# Altium schematic sheet hierarchy.SchDoc
size A3; SheetNumber: 1; SheetTotal: 15; SheetDescription: High Level Hierarchy
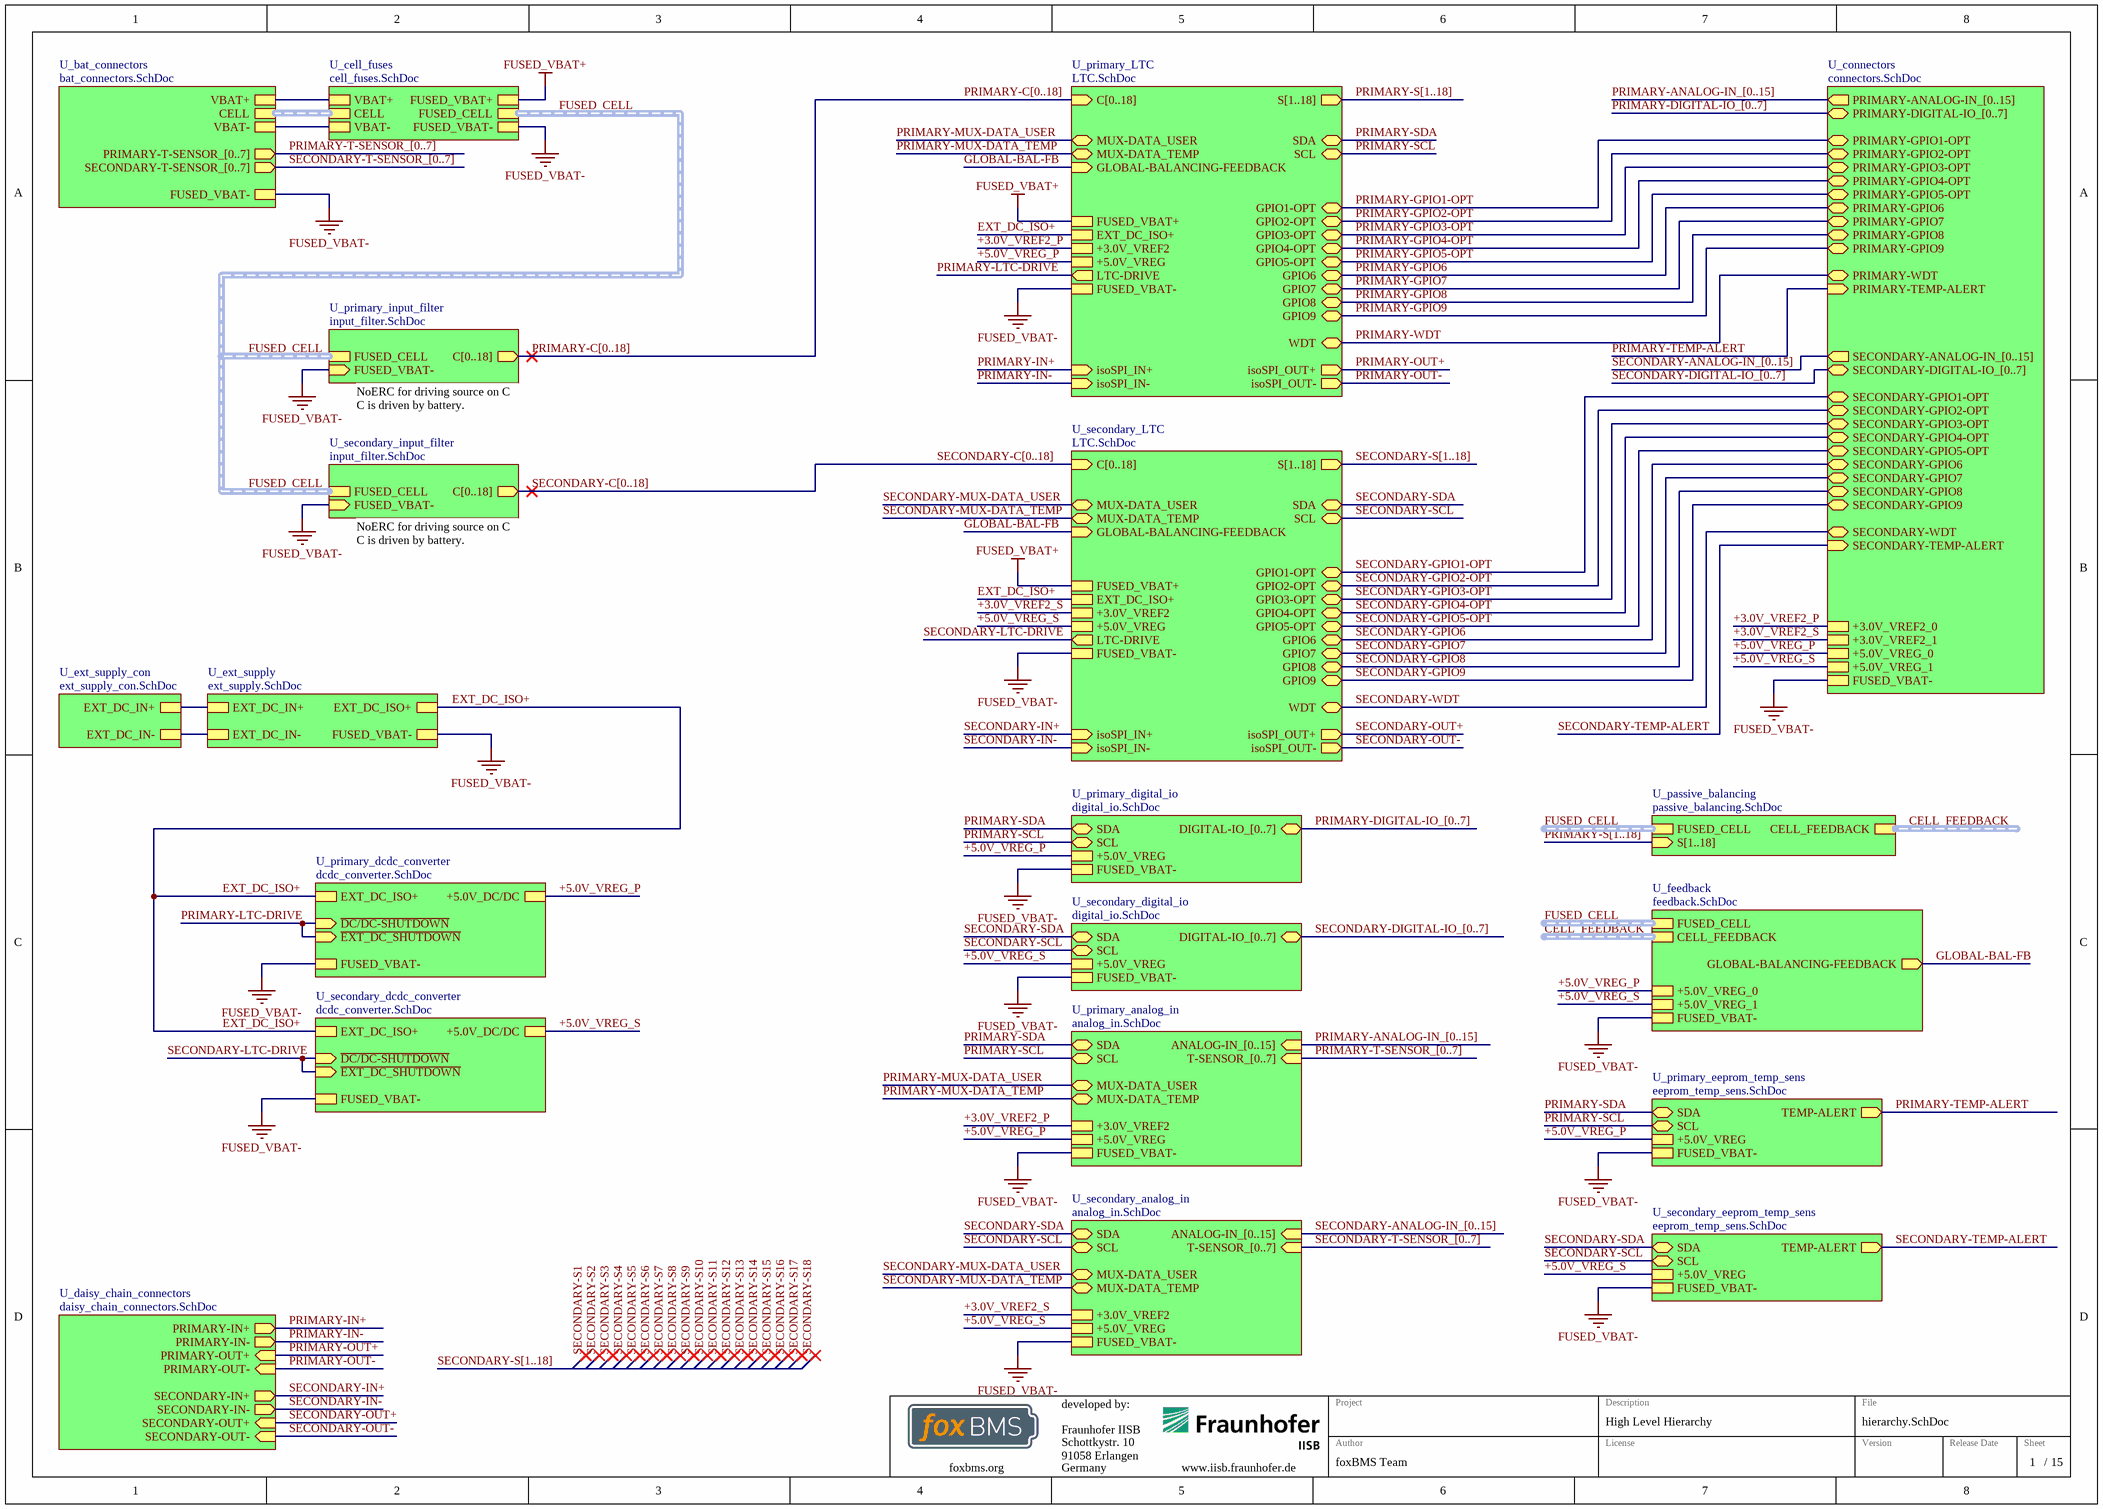
[diagram p0: hierarchy.SchDoc]

## Sub-sheets
U_bat_connectors = bat_connectors.SchDoc: CELL (harness CELL_VOLTAGES), PRIMARY-T-SENSOR_[0..7] (out), SECONDARY-T-SENSOR_[0..7] (out), VBAT+, VBAT-, FUSED_VBAT-
U_cell_fuses = cell_fuses.SchDoc: FUSED_CELL (harness CELL_VOLTAGES), CELL (harness CELL_VOLTAGES), VBAT+, VBAT-, FUSED_VBAT+, FUSED_VBAT-
U_connectors = connectors.SchDoc: PRIMARY-WDT (bidir), SECONDARY-WDT (bidir), PRIMARY-GPIO1-OPT (bidir), PRIMARY-GPIO2-OPT (bidir), PRIMARY-GPIO3-OPT (bidir), PRIMARY-GPIO4-OPT (bidir), PRIMARY-GPIO5-OPT (bidir), SECONDARY-GPIO1-OPT (bidir), SECONDARY-GPIO2-OPT (bidir), SECONDARY-GPIO3-OPT (bidir), SECONDARY-GPIO4-OPT (bidir), SECONDARY-GPIO5-OPT (bidir), PRIMARY-TEMP-ALERT (in), SECONDARY-TEMP-ALERT (in), SECONDARY-DIGITAL-IO_[0..7] (bidir), PRIMARY-DIGITAL-IO_[0..7] (bidir), PRIMARY-ANALOG-IN_[0..15] (out), SECONDARY-ANALOG-IN_[0..15] (out), PRIMARY-GPIO9 (bidir), PRIMARY-GPIO7 (bidir), PRIMARY-GPIO6 (bidir), PRIMARY-GPIO8 (bidir), SECONDARY-GPIO9 (bidir), SECONDARY-GPIO8 (bidir), SECONDARY-GPIO7 (bidir), SECONDARY-GPIO6 (bidir), +3.0V_VREF2_1, +5.0V_VREG_1, +3.0V_VREF2_0, FUSED_VBAT-, +5.0V_VREG_0
U_daisy_chain_connectors = daisy_chain_connectors.SchDoc: SECONDARY-IN+ (out), SECONDARY-IN- (out), SECONDARY-OUT+ (in), SECONDARY-OUT- (in), PRIMARY-IN+ (out), PRIMARY-IN- (out), PRIMARY-OUT- (in), PRIMARY-OUT+ (in)
U_ext_supply = ext_supply.SchDoc: EXT_DC_IN+, EXT_DC_IN-, EXT_DC_ISO+, FUSED_VBAT-
U_ext_supply_con = ext_supply_con.SchDoc: EXT_DC_IN+, EXT_DC_IN-
U_feedback = feedback.SchDoc: GLOBAL-BALANCING-FEEDBACK (out), CELL_FEEDBACK (harness CELL_FEEDBACK), FUSED_CELL (harness CELL_VOLTAGES), +5.0V_VREG_1, +5.0V_VREG_0, FUSED_VBAT-
U_passive_balancing = passive_balancing.SchDoc: FUSED_CELL (harness CELL_VOLTAGES), S[1..18] (in), CELL_FEEDBACK (harness CELL_FEEDBACK)
U_primary_analog_in = analog_in.SchDoc: MUX-DATA_TEMP (bidir), MUX-DATA_USER (bidir), ANALOG-IN_[0..15] (in), T-SENSOR_[0..7] (in), SCL (bidir), SDA (bidir), +5.0V_VREG, FUSED_VBAT-, +3.0V_VREF2
U_primary_dcdc_converter = dcdc_converter.SchDoc: +5.0V_DC/DC, FUSED_VBAT-, ~{DC/DC-SHUTDOWN} (in), EXT_DC_ISO+, ~{EXT_DC_SHUTDOWN} (in)
U_primary_digital_io = digital_io.SchDoc: SCL (bidir), SDA (bidir), DIGITAL-IO_[0..7] (bidir), +5.0V_VREG, FUSED_VBAT-
U_primary_eeprom_temp_sens = eeprom_temp_sens.SchDoc: TEMP-ALERT (out), SDA (bidir), SCL (bidir), FUSED_VBAT-, +5.0V_VREG
U_primary_input_filter = input_filter.SchDoc: FUSED_CELL (harness CELL_VOLTAGES), C[0..18] (out), FUSED_VBAT- (in)
U_primary_LTC = LTC.SchDoc: isoSPI_IN- (in), isoSPI_IN+ (in), isoSPI_OUT- (out), isoSPI_OUT+ (out), GPIO5-OPT (bidir), GPIO4-OPT (bidir), MUX-DATA_USER (bidir), GPIO1-OPT (bidir), SCL (bidir), GPIO2-OPT (bidir), MUX-DATA_TEMP (bidir), GPIO3-OPT (bidir), GLOBAL-BALANCING-FEEDBACK (in), SDA (bidir), EXT_DC_ISO+, C[0..18] (in), S[1..18] (out), WDT (bidir), GPIO8 (bidir), GPIO7 (bidir), GPIO9 (bidir), GPIO6 (bidir), FUSED_VBAT+, FUSED_VBAT-, +5.0V_VREG, +3.0V_VREF2, LTC-DRIVE (out)
U_secondary_analog_in = analog_in.SchDoc: MUX-DATA_TEMP (bidir), MUX-DATA_USER (bidir), ANALOG-IN_[0..15] (in), T-SENSOR_[0..7] (in), SCL (bidir), SDA (bidir), +5.0V_VREG, FUSED_VBAT-, +3.0V_VREF2
U_secondary_dcdc_converter = dcdc_converter.SchDoc: +5.0V_DC/DC, FUSED_VBAT-, ~{DC/DC-SHUTDOWN} (in), EXT_DC_ISO+, ~{EXT_DC_SHUTDOWN} (in)
U_secondary_digital_io = digital_io.SchDoc: SCL (bidir), SDA (bidir), DIGITAL-IO_[0..7] (bidir), +5.0V_VREG, FUSED_VBAT-
U_secondary_eeprom_temp_sens = eeprom_temp_sens.SchDoc: TEMP-ALERT (out), SDA (bidir), SCL (bidir), FUSED_VBAT-, +5.0V_VREG
U_secondary_input_filter = input_filter.SchDoc: FUSED_CELL (harness CELL_VOLTAGES), C[0..18] (out), FUSED_VBAT- (in)
U_secondary_LTC = LTC.SchDoc: isoSPI_IN- (in), isoSPI_IN+ (in), isoSPI_OUT- (out), isoSPI_OUT+ (out), GPIO5-OPT (bidir), GPIO4-OPT (bidir), MUX-DATA_USER (bidir), GPIO1-OPT (bidir), SCL (bidir), GPIO2-OPT (bidir), MUX-DATA_TEMP (bidir), GPIO3-OPT (bidir), GLOBAL-BALANCING-FEEDBACK (in), SDA (bidir), EXT_DC_ISO+, C[0..18] (in), S[1..18] (out), WDT (bidir), GPIO8 (bidir), GPIO7 (bidir), GPIO9 (bidir), GPIO6 (bidir), FUSED_VBAT+, FUSED_VBAT-, +5.0V_VREG, +3.0V_VREF2, LTC-DRIVE (out)

## Nets
FUSED_VBAT+: sheet U_cell_fuses/FUSED_VBAT+, sheet U_primary_LTC/FUSED_VBAT+, sheet U_secondary_LTC/FUSED_VBAT+
FUSED_VBAT-: sheet U_cell_fuses/FUSED_VBAT-, sheet U_primary_input_filter/FUSED_VBAT-, sheet U_secondary_input_filter/FUSED_VBAT-, sheet U_ext_supply/FUSED_VBAT-, sheet U_connectors/FUSED_VBAT-, sheet U_feedback/FUSED_VBAT-, sheet U_primary_LTC/FUSED_VBAT-, sheet U_secondary_digital_io/FUSED_VBAT-, sheet U_secondary_eeprom_temp_sens/FUSED_VBAT-, sheet U_secondary_analog_in/FUSED_VBAT-, sheet U_bat_connectors/FUSED_VBAT-, sheet U_primary_dcdc_converter/FUSED_VBAT-, sheet U_secondary_dcdc_converter/FUSED_VBAT-, sheet U_secondary_LTC/FUSED_VBAT-, sheet U_primary_digital_io/FUSED_VBAT-, sheet U_primary_eeprom_temp_sens/FUSED_VBAT-, sheet U_primary_analog_in/FUSED_VBAT-
+3.0V_VREF2_P: sheet U_connectors/+3.0V_VREF2_0, sheet U_primary_LTC/+3.0V_VREF2, sheet U_primary_analog_in/+3.0V_VREF2
+3.0V_VREF2_S: sheet U_connectors/+3.0V_VREF2_1, sheet U_secondary_analog_in/+3.0V_VREF2, sheet U_secondary_LTC/+3.0V_VREF2
+5.0V_VREG_P: sheet U_connectors/+5.0V_VREG_0, sheet U_feedback/+5.0V_VREG_0, sheet U_primary_LTC/+5.0V_VREG, sheet U_primary_dcdc_converter/+5.0V_DC/DC, sheet U_primary_digital_io/+5.0V_VREG, sheet U_primary_eeprom_temp_sens/+5.0V_VREG, sheet U_primary_analog_in/+5.0V_VREG
+5.0V_VREG_S: sheet U_connectors/+5.0V_VREG_1, sheet U_feedback/+5.0V_VREG_1, sheet U_secondary_digital_io/+5.0V_VREG, sheet U_secondary_eeprom_temp_sens/+5.0V_VREG, sheet U_secondary_analog_in/+5.0V_VREG, sheet U_secondary_dcdc_converter/+5.0V_DC/DC, sheet U_secondary_LTC/+5.0V_VREG
EXT_DC_ISO+: sheet U_ext_supply/EXT_DC_ISO+, sheet U_primary_LTC/EXT_DC_ISO+, sheet U_primary_dcdc_converter/EXT_DC_ISO+, sheet U_secondary_dcdc_converter/EXT_DC_ISO+, sheet U_secondary_LTC/EXT_DC_ISO+
GLOBAL-BAL-FB: sheet U_feedback/GLOBAL-BALANCING-FEEDBACK, sheet U_primary_LTC/GLOBAL-BALANCING-FEEDBACK, sheet U_secondary_LTC/GLOBAL-BALANCING-FEEDBACK
PRIMARY-GPIO1-OPT: sheet U_connectors/PRIMARY-GPIO1-OPT, sheet U_primary_LTC/GPIO1-OPT
PRIMARY-GPIO2-OPT: sheet U_connectors/PRIMARY-GPIO2-OPT, sheet U_primary_LTC/GPIO2-OPT
PRIMARY-GPIO3-OPT: sheet U_connectors/PRIMARY-GPIO3-OPT, sheet U_primary_LTC/GPIO3-OPT
PRIMARY-GPIO4-OPT: sheet U_connectors/PRIMARY-GPIO4-OPT, sheet U_primary_LTC/GPIO4-OPT
PRIMARY-GPIO5-OPT: sheet U_connectors/PRIMARY-GPIO5-OPT, sheet U_primary_LTC/GPIO5-OPT
PRIMARY-GPIO6: sheet U_connectors/PRIMARY-GPIO6, sheet U_primary_LTC/GPIO6
PRIMARY-GPIO7: sheet U_connectors/PRIMARY-GPIO7, sheet U_primary_LTC/GPIO7
PRIMARY-GPIO8: sheet U_connectors/PRIMARY-GPIO8, sheet U_primary_LTC/GPIO8
PRIMARY-GPIO9: sheet U_connectors/PRIMARY-GPIO9, sheet U_primary_LTC/GPIO9
PRIMARY-IN+: sheet U_primary_LTC/isoSPI_IN+, sheet U_daisy_chain_connectors/PRIMARY-IN+
PRIMARY-IN-: sheet U_primary_LTC/isoSPI_IN-, sheet U_daisy_chain_connectors/PRIMARY-IN-
PRIMARY-LTC-DRIVE: sheet U_primary_LTC/LTC-DRIVE, sheet U_primary_dcdc_converter/~{DC/DC-SHUTDOWN}, sheet U_primary_dcdc_converter/~{EXT_DC_SHUTDOWN}
PRIMARY-MUX-DATA_TEMP: sheet U_primary_LTC/MUX-DATA_TEMP, sheet U_primary_analog_in/MUX-DATA_TEMP
PRIMARY-MUX-DATA_USER: sheet U_primary_LTC/MUX-DATA_USER, sheet U_primary_analog_in/MUX-DATA_USER
PRIMARY-OUT+: sheet U_primary_LTC/isoSPI_OUT+, sheet U_daisy_chain_connectors/PRIMARY-OUT+
PRIMARY-OUT-: sheet U_primary_LTC/isoSPI_OUT-, sheet U_daisy_chain_connectors/PRIMARY-OUT-
PRIMARY-SCL: sheet U_primary_LTC/SCL, sheet U_primary_digital_io/SCL, sheet U_primary_eeprom_temp_sens/SCL, sheet U_primary_analog_in/SCL
PRIMARY-SDA: sheet U_primary_LTC/SDA, sheet U_primary_digital_io/SDA, sheet U_primary_eeprom_temp_sens/SDA, sheet U_primary_analog_in/SDA
PRIMARY-TEMP-ALERT: sheet U_connectors/PRIMARY-TEMP-ALERT, sheet U_primary_eeprom_temp_sens/TEMP-ALERT
PRIMARY-WDT: sheet U_connectors/PRIMARY-WDT, sheet U_primary_LTC/WDT
SECONDARY-GPIO1-OPT: sheet U_connectors/SECONDARY-GPIO1-OPT, sheet U_secondary_LTC/GPIO1-OPT
SECONDARY-GPIO2-OPT: sheet U_connectors/SECONDARY-GPIO2-OPT, sheet U_secondary_LTC/GPIO2-OPT
SECONDARY-GPIO3-OPT: sheet U_connectors/SECONDARY-GPIO3-OPT, sheet U_secondary_LTC/GPIO3-OPT
SECONDARY-GPIO4-OPT: sheet U_connectors/SECONDARY-GPIO4-OPT, sheet U_secondary_LTC/GPIO4-OPT
SECONDARY-GPIO5-OPT: sheet U_connectors/SECONDARY-GPIO5-OPT, sheet U_secondary_LTC/GPIO5-OPT
SECONDARY-GPIO6: sheet U_connectors/SECONDARY-GPIO6, sheet U_secondary_LTC/GPIO6
SECONDARY-GPIO7: sheet U_connectors/SECONDARY-GPIO7, sheet U_secondary_LTC/GPIO7
SECONDARY-GPIO8: sheet U_connectors/SECONDARY-GPIO8, sheet U_secondary_LTC/GPIO8
SECONDARY-GPIO9: sheet U_connectors/SECONDARY-GPIO9, sheet U_secondary_LTC/GPIO9
SECONDARY-IN+: sheet U_daisy_chain_connectors/SECONDARY-IN+, sheet U_secondary_LTC/isoSPI_IN+
SECONDARY-IN-: sheet U_daisy_chain_connectors/SECONDARY-IN-, sheet U_secondary_LTC/isoSPI_IN-
SECONDARY-LTC-DRIVE: sheet U_secondary_dcdc_converter/~{DC/DC-SHUTDOWN}, sheet U_secondary_dcdc_converter/~{EXT_DC_SHUTDOWN}, sheet U_secondary_LTC/LTC-DRIVE
SECONDARY-MUX-DATA_TEMP: sheet U_secondary_analog_in/MUX-DATA_TEMP, sheet U_secondary_LTC/MUX-DATA_TEMP
SECONDARY-MUX-DATA_USER: sheet U_secondary_analog_in/MUX-DATA_USER, sheet U_secondary_LTC/MUX-DATA_USER
SECONDARY-OUT+: sheet U_daisy_chain_connectors/SECONDARY-OUT+, sheet U_secondary_LTC/isoSPI_OUT+
SECONDARY-OUT-: sheet U_daisy_chain_connectors/SECONDARY-OUT-, sheet U_secondary_LTC/isoSPI_OUT-
SECONDARY-SCL: sheet U_secondary_digital_io/SCL, sheet U_secondary_eeprom_temp_sens/SCL, sheet U_secondary_analog_in/SCL, sheet U_secondary_LTC/SCL
SECONDARY-SDA: sheet U_secondary_digital_io/SDA, sheet U_secondary_eeprom_temp_sens/SDA, sheet U_secondary_analog_in/SDA, sheet U_secondary_LTC/SDA
SECONDARY-TEMP-ALERT: sheet U_connectors/SECONDARY-TEMP-ALERT, sheet U_secondary_eeprom_temp_sens/TEMP-ALERT
SECONDARY-WDT: sheet U_connectors/SECONDARY-WDT, sheet U_secondary_LTC/WDT
(unnamed): sheet U_cell_fuses/VBAT+, sheet U_bat_connectors/VBAT+
(unnamed): sheet U_cell_fuses/VBAT-, sheet U_bat_connectors/VBAT-
(unnamed): sheet U_ext_supply/EXT_DC_IN+, sheet U_ext_supply_con/EXT_DC_IN+
(unnamed): sheet U_ext_supply/EXT_DC_IN-, sheet U_ext_supply_con/EXT_DC_IN-

## Buses and harness runs
bus PRIMARY-ANALOG-IN_[0..15] = sheet U_connectors/PRIMARY-ANALOG-IN_[0..15]
bus PRIMARY-ANALOG-IN_[0..15] = sheet U_primary_analog_in/ANALOG-IN_[0..15]
bus PRIMARY-C[0..18] = sheet U_primary_input_filter/C[0..18] = sheet U_primary_LTC/C[0..18]
bus PRIMARY-DIGITAL-IO_[0..7] = sheet U_connectors/PRIMARY-DIGITAL-IO_[0..7]
bus PRIMARY-DIGITAL-IO_[0..7] = sheet U_primary_digital_io/DIGITAL-IO_[0..7]
bus PRIMARY-S[1..18] = sheet U_passive_balancing/S[1..18]
bus PRIMARY-S[1..18] = sheet U_primary_LTC/S[1..18]
bus PRIMARY-T-SENSOR_[0..7] = sheet U_bat_connectors/PRIMARY-T-SENSOR_[0..7]
bus PRIMARY-T-SENSOR_[0..7] = sheet U_primary_analog_in/T-SENSOR_[0..7]
bus SECONDARY-ANALOG-IN_[0..15] = sheet U_connectors/SECONDARY-ANALOG-IN_[0..15]
bus SECONDARY-ANALOG-IN_[0..15] = sheet U_secondary_analog_in/ANALOG-IN_[0..15]
bus SECONDARY-C[0..18] = sheet U_secondary_input_filter/C[0..18] = sheet U_secondary_LTC/C[0..18]
bus SECONDARY-DIGITAL-IO_[0..7] = sheet U_connectors/SECONDARY-DIGITAL-IO_[0..7]
bus SECONDARY-DIGITAL-IO_[0..7] = sheet U_secondary_digital_io/DIGITAL-IO_[0..7]
bus SECONDARY-S[1..18]
bus SECONDARY-S[1..18] = sheet U_secondary_LTC/S[1..18]
bus SECONDARY-T-SENSOR_[0..7] = sheet U_bat_connectors/SECONDARY-T-SENSOR_[0..7]
bus SECONDARY-T-SENSOR_[0..7] = sheet U_secondary_analog_in/T-SENSOR_[0..7]
harness CELL_FEEDBACK = sheet U_feedback/CELL_FEEDBACK
harness CELL_FEEDBACK = sheet U_passive_balancing/CELL_FEEDBACK
harness FUSED_CELL = sheet U_cell_fuses/FUSED_CELL = sheet U_primary_input_filter/FUSED_CELL = sheet U_secondary_input_filter/FUSED_CELL
harness FUSED_CELL = sheet U_feedback/FUSED_CELL
harness FUSED_CELL = sheet U_passive_balancing/FUSED_CELL
harness sheet U_bat_connectors/CELL = sheet U_cell_fuses/CELL

## Notes on the sheet
- NoERC for driving source on C
  C is driven by battery.
- Labels drawn without touching a wire or pin: SECONDARY-S1, SECONDARY-S2, SECONDARY-S3, SECONDARY-S4, SECONDARY-S5, SECONDARY-S6, SECONDARY-S7, SECONDARY-S8, SECONDARY-S9, SECONDARY-S10, SECONDARY-S11, SECONDARY-S12, SECONDARY-S13, SECONDARY-S14, SECONDARY-S15, SECONDARY-S16, SECONDARY-S17, SECONDARY-S18
- Fraunhofer IISB
- Schottkystr. 10
- developed by:
- 91058 Erlangen
- Germany
- Author
- Project
- License
- Description
- File
- Version
- Release Date
- Sheet
- foxbms.org <https://foxbms.org>
- www.iisb.fraunhofer.de <https://www.iisb.fraunhofer.de/>
- foxBMS Team
- /